# Altium schematic sheet Sheet1.SchDoc
size A; SheetNumber: 1; SheetTotal: 1
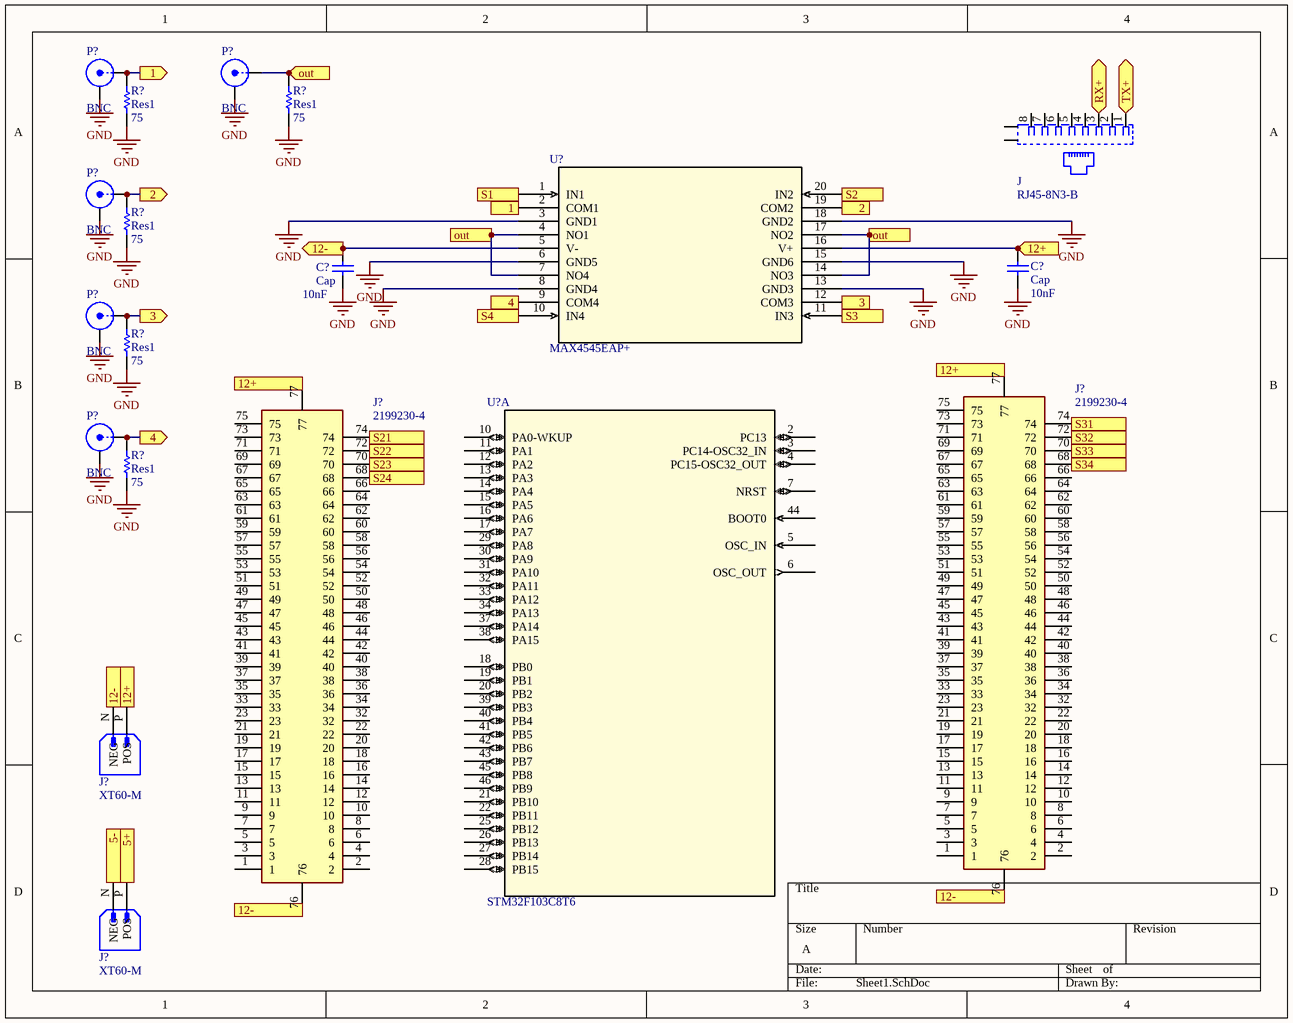
[diagram p0: Sheet1.SchDoc]

## Parts
(Parts that share a designator on the sheet are numbered #1, #2 ... from top to bottom, then left to right.)
C?#1  Cap  value 10nF  [RAD-0.3]
C?#2  Cap  value 10nF  [RAD-0.3]
J  RJ45-8N3-B  [TE_RJ45-8N3-B]
J?#1  XT60-M  [AMASS_XT60-M]
J?#2  2199230-4  [21992304]
J?#3  XT60-M  [AMASS_XT60-M]
J?#4  2199230-4  [21992304]
P?#1  BNC  [BNC_RA CON]
P?#2  BNC  [BNC_RA CON]
P?#3  BNC  [BNC_RA CON]
P?#4  BNC  [BNC_RA CON]
P?#5  BNC  [BNC_RA CON]
R?#1  Res1  value 75  [AXIAL-0.3]
R?#2  Res1  value 75  [AXIAL-0.3]
R?#3  Res1  value 75  [AXIAL-0.3]
R?#4  Res1  value 75  [AXIAL-0.3]
R?#5  Res1  value 75  [AXIAL-0.3]
U?#1  MAX4545EAP+  [max4545eap+]
U?#2  STM32F103C8T6  [LQFP48-7x7mm]  (part A of 2)

## Ports
1 (in), 1 (out), 2 (in), 2 (out), 3 (in), 3 (out), 4 (in), 4 (out), 5+ (out), 5- (in), 12+, 12+ (in), 12+ (out), 12-, 12- (in), 12- (out), out (in), out (out), RX+ (bidir), S1 (in), S2 (in), S3 (in), S4 (in), S21 (out), S22, S23, S24, S31 (out), S32, S33, S34, TX+ (bidir)

## Nets
GND: C?#1.2 C?#2.2 P?#1.2(Y) P?#2.2(Y) P?#3.2(Y) P?#4.2(Y) P?#5.2(Y) R?#1.1 R?#2.1 R?#3.2 R?#4.2 R?#5.2 U?#1.3(GND1) U?#1.6(GND5) U?#1.8(GND4) U?#1.13(GND3) U?#1.15(GND6) U?#1.18(GND2)
1: P?#1.1(X) R?#1.2 U?#1.2(COM1) ; port 1
2: P?#3.1(X) R?#3.1 U?#1.19(COM2) ; port 2
3: P?#4.1(X) R?#4.1 U?#1.12(COM3) ; port 3
4: P?#5.1(X) R?#5.1 U?#1.9(COM4) ; port 4
5+: J?#3.P(POS) ; port 5+
5-: J?#3.N(NEG) ; port 5-
12+: C?#2.1 J?#1.P(POS) J?#2.77 J?#4.77 U?#1.16(V+) ; port 12+
12-: C?#1.1 J?#1.N(NEG) J?#2.76 J?#4.76 U?#1.5(V-) ; port 12-
out: P?#2.1(X) R?#2.2 U?#1.4(NO1) U?#1.7(NO4) U?#1.14(NO3) U?#1.17(NO2) ; port out
RX+: J.3 ; port RX+
S1: U?#1.1(IN1) ; port S1
S2: U?#1.20(IN2) ; port S2
S3: U?#1.11(IN3) ; port S3
S4: U?#1.10(IN4) ; port S4
S21: J?#4.74 ; port S21
S22: J?#4.72 ; port S22
S23: J?#4.70 ; port S23
S24: J?#4.68 ; port S24
S31: J?#2.74 ; port S31
S32: J?#2.72 ; port S32
S33: J?#2.70 ; port S33
S34: J?#2.68 ; port S34
TX+: J.1 ; port TX+

Not connected (* = marked no-connect by the designer): J 2 4 5 6 7 8 9(S1) 10(S2); J?#2 1 2 3 4 5 6 7 8 9 10 11 12 13 14 15 16 17 18 19 20 21 22 23 32 33 34 35 36 37 38 39 40 41 42 43 44 45 46 47 48 49 50 51 52 53 54 55 56 57 58 59 60 61 62 63 64 65 66 67 69 71 73 75; J?#4 1 2 3 4 5 6 7 8 9 10 11 12 13 14 15 16 17 18 19 20 21 22 23 32 33 34 35 36 37 38 39 40 41 42 43 44 45 46 47 48 49 50 51 52 53 54 55 56 57 58 59 60 61 62 63 64 65 66 67 69 71 73 75; U?#2 2(PC13) 3(PC14-OSC32_IN) 4(PC15-OSC32_OUT) 5(OSC_IN) 6(OSC_OUT) 7(NRST) 10(PA0-WKUP) 11(PA1) 12(PA2) 13(PA3) 14(PA4) 15(PA5) 16(PA6) 17(PA7) 18(PB0) 19(PB1) 20(PB2) 21(PB10) 22(PB11) 25(PB12) 26(PB13) 27(PB14) 28(PB15) 29(PA8) 30(PA9) 31(PA10) 32(PA11) 33(PA12) 34(PA13) 37(PA14) 38(PA15) 39(PB3) 40(PB4) 41(PB5) 42(PB6) 43(PB7) 44(BOOT0) 45(PB8) 46(PB9)

## Library data of the parts
C?#1 C?#2 = Cap: Capacitor; Published: 8-Jun-2000; LatestRevisionDate: 17-Jul-2002; LatestRevisionNote: Re-released for DXP Platform.; PackageReference: RAD-0.3; Publisher: Altium Limited; PackageDescription: Radial Cap, Thru-Hole; 2 Leads; 0.3 in Pin Spacing
J = RJ45-8N3-B: Connector RJ-45 Female 8 Position 2.54mm Solder Right Angle Through Hole 8 Terminal; MF: TE Connectivity; MP: RJ45-8N3-B; Price: None; Availability: Unavailable; Package: None; SnapEDA_Link: https://www.snapeda.com/parts/RJ45-8N3-B/TE%20Connectivity%20Corcom%20Filters/view-part/2770351/?ref=snap; TE_purchase_URL: https://www.te.com/usa-en/product-1-6609212-3.html?te_bu=Cor&te_type=disp&te_campaign=seda_glo_cor-seda-global-disp-prtnr-fy19-seda-model-bom-cta_sma-317_1&elqCampaignId=32493; Value: *
J?#1 J?#3 = XT60-M: Plug; DC supply; XT60; male; PIN: 2; for cable; soldered; 30A; 500V; MF: AMASS; Package: Package; Availability: Not in stock; SnapEDA_Link: https://www.snapeda.com/parts/XT60-M/AMASS/view-part/?ref=snap; Check_prices: https://www.snapeda.com/parts/XT60-M/AMASS/view-part/?ref=eda; MP: XT60-M; Price: None; Value: *
J?#2 J?#4 = 2199230-4: Connector; Manufacturer_Name: TE Connectivity; Datasheet Link: https://componentsearchengine.com//2199230-4.pdf; Mouser2 Part Number: 571-2199230-4; Mouser2 Price/Stock: https://www.mouser.com/Search/Refine.aspx?Keyword=571-2199230-4; Manufacturer_Part_Number: 2199230-4
P?#1-P?#5 = BNC: BNC Elbow Connector; LatestRevisionDate: 17-Jul-2002; LatestRevisionNote: Re-released for DXP Platform.; Publisher: Altium Limited
R?#1-R?#5 = Res1: Resistor; Published: 8-Jun-2000; LatestRevisionDate: 17-Jul-2002; LatestRevisionNote: Re-released for DXP Platform.; PackageReference: AXIAL-0.3; Publisher: Altium Limited; PackageDescription: Axial Device, Thru-Hole; 2 Leads; 0.3 in Pin Spacing
U?#1 = MAX4545EAP+: No Description Available; Mfr_Name: Maxim Integrated Products; Copyright: Copyright (C) 2022 Ultra Librarian. All rights reserved.; Manufacturer_Part_Number: MAX4545EAP+; RefDes: RefDes; Type: DEV
U?#2 = STM32F103C8T6: No Description Available; Mfr_Name: STMicroelectronics; Copyright: Copyright (C) 2022 Ultra Librarian. All rights reserved.; Manufacturer_Part_Number: STM32F103C8T6; RefDes: RefDes; Type: DEV